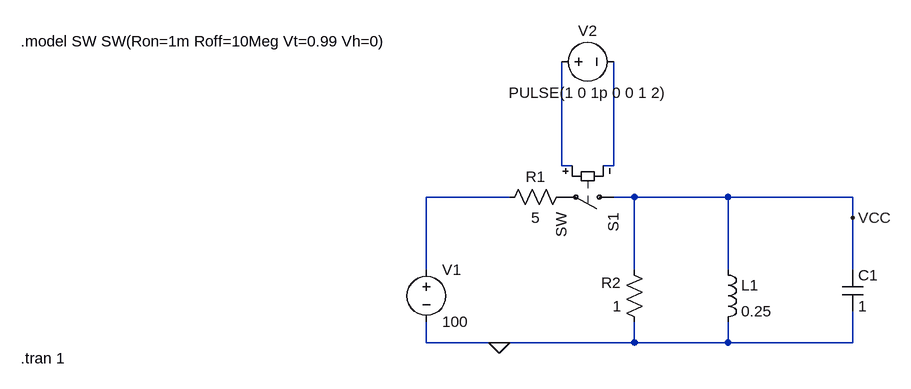
[diagram p0: schematic Q8_8.asc]
Q8_8.asc, the LTspice schematic file:
Version 4
SHEET 1 880 680
WIRE 272 -48 272 -208
WIRE 288 -48 272 -48
WIRE 352 -48 352 -208
WIRE 352 -48 336 -48
WIRE 192 0 64 0
WIRE 384 0 352 0
WIRE 528 0 384 0
WIRE 720 0 528 0
WIRE 720 32 720 0
WIRE 64 112 64 0
WIRE 384 112 384 0
WIRE 528 112 528 0
WIRE 720 112 720 32
WIRE 64 224 64 192
WIRE 176 224 64 224
WIRE 384 224 384 192
WIRE 384 224 176 224
WIRE 528 224 528 192
WIRE 528 224 384 224
WIRE 720 224 720 176
WIRE 720 224 528 224
FLAG 176 224 0
FLAG 720 32 VCC
SYMBOL voltage 64 96 R0
WINDOW 123 0 0 Left 0
WINDOW 39 0 0 Left 0
SYMATTR InstName V1
SYMATTR Value 100
SYMBOL res 288 -16 R90
WINDOW 0 0 56 VBottom 2
WINDOW 3 32 56 VTop 2
SYMATTR InstName R1
SYMATTR Value 5
SYMBOL res 400 208 R180
WINDOW 0 36 76 Left 2
WINDOW 3 36 40 Left 2
SYMATTR InstName R2
SYMATTR Value 1
SYMBOL ind 512 96 R0
SYMATTR InstName L1
SYMATTR Value 0.25
SYMBOL cap 704 112 R0
SYMATTR InstName C1
SYMATTR Value 1
SYMBOL sw 368 0 R90
SYMATTR InstName S1
SYMBOL voltage 256 -208 R270
WINDOW 0 32 56 VTop 2
WINDOW 3 -32 56 VBottom 2
WINDOW 123 0 0 Left 0
WINDOW 39 0 0 Left 0
SYMATTR InstName V2
SYMATTR Value PULSE(1 0 1p 0 0 1 2)
TEXT -560 -240 Left 2 !.model SW SW(Ron=1m Roff=10Meg Vt=0.99 Vh=0)
TEXT -560 248 Left 2 !.tran 1

The netlist it stands for:
* Q8_8.asc
V1 N003 0 100
R1 P001 N003 5
R2 0 VCC 1
L1 VCC 0 0.25
C1 VCC 0 1
S1 VCC P001 N001 N002 SW
V2 N001 N002 PULSE(1 0 1p 0 0 1 2)
.model SW SW(Ron=1m Roff=10Meg Vt=0.99 Vh=0)
.tran 1
.backanno
.end